# Altium project PiDSP.PrjPcb (part 2 of 2)

## Sheet DSPPower.SchDoc: Decoupling
size A4; Date: 08.04.2017; Author: Jan Petrik; CompanyName: FreeDSP; DrawnBy: Jan Petrik; Organization: FreeDSP; DocumentNumber: 7; Revision: B3; SheetNumber: 7; SheetTotal: 16; email: jan_petrik@centrum.cz; license: CC BY-NC 4.0
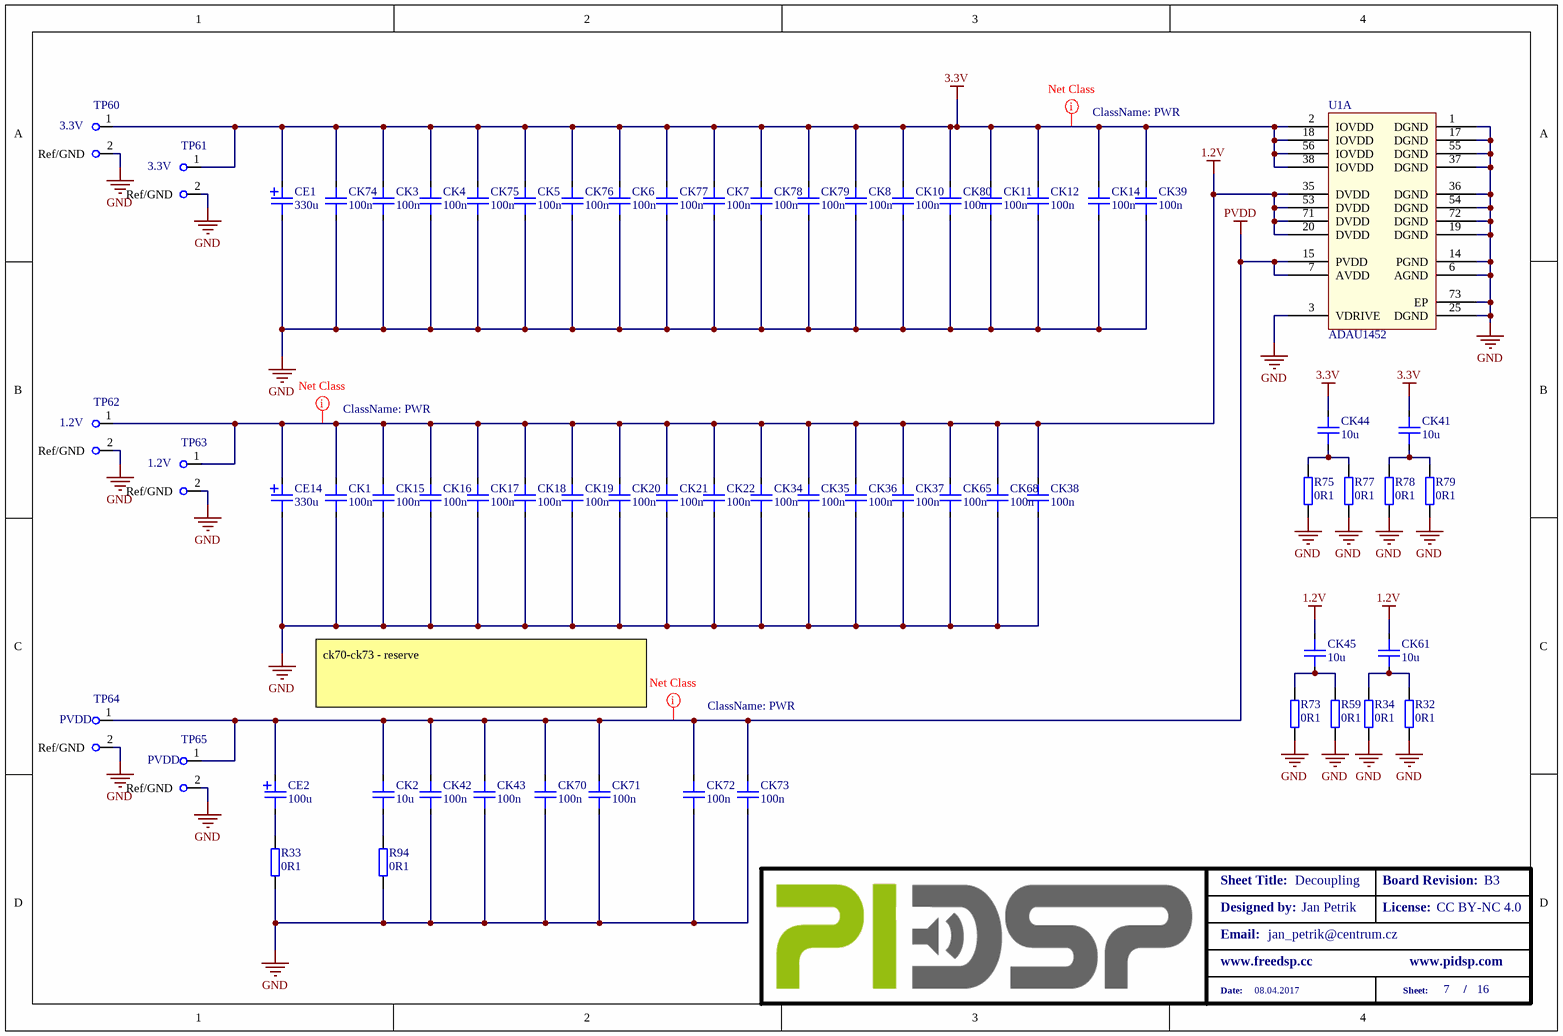
[diagram p10: DSPPower.SchDoc]

### Parts
CE1  330u  [CAPAE6.8X6.8(D_SIZE)]
CE2  100u  [CAPAE6.8X6.8(D_SIZE)]
CE14  330u  [CAPAE6.8X6.8(D_SIZE)]
CK1  100n  [CAPC1608X09N(SMC0603)]
CK2  10u  [CAPC3216X12N(SMC1206)]
CK3  100n  [CAPC1608X09N(SMC0603)_Fanout]
CK4  100n  [CAPC1608X09N(SMC0603)_Fanout]
CK5  100n  [CAPC1608X09N(SMC0603)_Fanout]
CK6  100n  [CAPC1608X09N(SMC0603)_Fanout]
CK7  100n  [CAPC1608X09N(SMC0603)_Fanout]
CK8  100n  [CAPC1608X09N(SMC0603)_Fanout]
CK10  100n  [CAPC1608X09N(SMC0603)_Fanout]
CK11  100n  [CAPC1608X09N(SMC0603)]
CK12  100n  [CAPC1608X09N(SMC0603)]
CK14  100n  [CAPC1608X09N(SMC0603)]
CK15  100n  [CAPC1608X09N(SMC0603)]
CK16  100n  [CAPC1608X09N(SMC0603)]
CK17  100n  [CAPC1608X09N(SMC0603)]
CK18  100n  [CAPC1608X09N(SMC0603)]
CK19  100n  [CAPC1608X09N(SMC0603)]
CK20  100n  [CAPC1608X09N(SMC0603)]
CK21  100n  [CAPC1608X09N(SMC0603)]
CK22  100n  [CAPC1608X09N(SMC0603)]
CK34  100n  [CAPC1608X09N(SMC0603)]
CK35  100n  [CAPC1608X09N(SMC0603)]
CK36  100n  [CAPC1608X09N(SMC0603)]
CK37  100n  [CAPC1608X09N(SMC0603)]
CK38  100n  [CAPC1608X09N(SMC0603)]
CK39  100n  [CAPC1608X09N(SMC0603)]
CK41  10u  [CAPC3216X12N(SMC1206)]
CK42  100n  [CAPC1608X09N(SMC0603)]
CK43  100n  [CAPC1608X09N(SMC0603)]
CK44  10u  [CAPC3216X12N(SMC1206)]
CK45  10u  [CAPC3216X12N(SMC1206)]
CK61  10u  [CAPC3216X12N(SMC1206)]
CK65  100n  [CAPC1608X09N(SMC0603)]
CK68  100n  [CAPC1608X09N(SMC0603)]
CK70  100n  [CAPC1608X09N(SMC0603)]
CK71  100n  [CAPC1608X09N(SMC0603)]
CK72  100n  [CAPC1608X09N(SMC0603)]
CK73  100n  [CAPC1608X09N(SMC0603)]
CK74  100n  [CAPC1608X09N(SMC0603)_Fanout]
CK75  100n  [CAPC1608X09N(SMC0603)_Fanout]
CK76  100n  [CAPC1608X09N(SMC0603)_Fanout]
CK77  100n  [CAPC1608X09N(SMC0603)_Fanout]
CK78  100n  [CAPC1608X09N(SMC0603)_Fanout]
CK79  100n  [CAPC1608X09N(SMC0603)_Fanout]
CK80  100n  [CAPC1608X09N(SMC0603)_Fanout]
R32  0R1  [RESC1608X06N(SMR0603)]
R33  0R1  [RESC1608X06N(SMR0603)]
R34  0R1  [RESC1608X06N(SMR0603)]
R59  0R1  [RESC1608X06N(SMR0603)]
R73  0R1  [RESC1608X06N(SMR0603)]
R75  0R1  [RESC1608X06N(SMR0603)]
R77  0R1  [RESC1608X06N(SMR0603)]
R78  0R1  [RESC1608X06N(SMR0603)]
R79  0R1  [RESC1608X06N(SMR0603)]
R94  0R1  [RESC1608X06N(SMR0603)]
TP60  3.3V  [HS/PDN_Testpoint]  (no BOM)
TP61  3.3V  [HS/PDN_Testpoint]  (no BOM)
TP62  1.2V  [HS/PDN_Testpoint]  (no BOM)
TP63  1.2V  [HS/PDN_Testpoint]  (no BOM)
TP64  PVDD  [HS/PDN_Testpoint]  (no BOM)
TP65  PVDD  [HS/PDN_Testpoint]  (no BOM)
U1  ADAU1452  [CP_72_6-handsoldering]  (part A of 6)

### Nets
1.2V: CE14.1 CK1.1 CK15.1 CK16.1 CK17.1 CK18.1 CK19.1 CK20.1 CK21.1 CK22.1 CK34.1 CK35.1 CK36.1 CK37.1 CK38.1 CK45.1 CK61.1 CK65.1 CK68.1 TP62.1 TP63.1 U1.20(DVDD) U1.35(DVDD) U1.53(DVDD) U1.71(DVDD)
3.3V: CE1.1 CK3.1 CK4.1 CK5.1 CK6.1 CK7.1 CK8.1 CK10.1 CK11.1 CK12.1 CK14.1 CK39.1 CK41.1 CK44.1 CK74.1 CK75.1 CK76.1 CK77.1 CK78.1 CK79.1 CK80.1 TP60.1 TP61.1 U1.2(IOVDD) U1.18(IOVDD) U1.38(IOVDD) U1.56(IOVDD)
GND: CE1.2 CE14.2 CK1.2 CK3.2 CK4.2 CK5.2 CK6.2 CK7.2 CK8.2 CK10.2 CK11.2 CK12.2 CK14.2 CK15.2 CK16.2 CK17.2 CK18.2 CK19.2 CK20.2 CK21.2 CK22.2 CK34.2 CK35.2 CK36.2 CK37.2 CK38.2 CK39.2 CK42.2 CK43.2 CK65.2 CK68.2 CK70.2 CK71.2 CK72.2 CK73.2 CK74.2 CK75.2 CK76.2 CK77.2 CK78.2 CK79.2 CK80.2 R32.2 R33.2 R34.2 R59.2 R73.2 R75.2 R77.2 R78.2 R79.2 R94.2 TP60.2(Ref/GND) TP61.2(Ref/GND) TP62.2(Ref/GND) TP63.2(Ref/GND) TP64.2(Ref/GND) TP65.2(Ref/GND) U1.1(DGND) U1.3(VDRIVE) U1.6(AGND) U1.14(PGND) U1.17(DGND) U1.19(DGND) U1.25(DGND) U1.36(DGND) U1.37(DGND) U1.54(DGND) U1.55(DGND) U1.72(DGND) U1.73(EP)
PVDD: CE2.1 CK2.1 CK42.1 CK43.1 CK70.1 CK71.1 CK72.1 CK73.1 TP64.1 TP65.1 U1.7(AVDD) U1.15(PVDD)
NetCE2_2: CE2.2 R33.1
NetCK2_2: CK2.2 R94.1
NetCK41_2: CK41.2 R78.1 R79.1
NetCK44_2: CK44.2 R75.1 R77.1
NetCK45_2: CK45.2 R59.1 R73.1
NetCK61_2: CK61.2 R32.1 R34.1

### Layout directives
net class PWR: 1.2V, 3.3V, PVDD

### Notes on the sheet
- ck70-ck73 - reserve
- Designed by:
- Sheet Title:
- Board Revision:
- License:
- Email:
- www.freedsp.cc
- www.pidsp.com
- Date:
- Sheet:
- /

### Library data of the parts
CE1 CE14 = 330u-6.3V-B6-OSCON: Polymer Aluminium Solid Capacitor 330uF, 6.3V; Signal Integrity: Cap; Tolerance: 20%/35V; Value: 330u; Package: D8H6.3; Simulation: Cap; Author: JP/27.03.2014; Voltage: 6.3V; Supplier 1: Mouser; Supplier Part Number 1: 710-875105144010
CE2 = 100u-16V-B6-OSCON: Polymer Aluminium Solid Capacitor 100uF, 16V; Mfg. Part Number: 875105344010; Signal Integrity: Cap; Tolerance: 20%/16V; Mfgr.: Wurth; Value: 100u; Package: D8H6.3; Simulation: Cap; Author: JP/27.03.2014; Voltage: 16V; Supplier 1: Mouser; Supplier Part Number 1: 710-875105344010
CK1 CK3 CK4 CK15 CK16 CK22 CK34-CK38 CK42 CK65 CK68 = 100n-50V-0603-X7R: MLCC; Signal Integrity: Cap; Tolerance: 10%; Voltage: 50V; Value: 100n; Package: SMC2523; Simulation: Cap; Author: JP/27.03.2014; Supplier 1: Mouser; Supplier Part Number 1: 81-GRM39X104K50D
CK2 CK41 CK44 CK45 CK61 = 10u-50V-1206-X5R: MLCC; Signal Integrity: Cap; Tolerance: 10%; Voltage: 50; Mfgr. PN: GRM31CR61H106MA2L; Mfgr.: Murata; Value: 10u; Package: SMC1206; Simulation: Cap; Author: JP/10.06.2014; Supplier 1: Mouser; Supplier Part Number 1: 81-GRM31CR61H106MA2L
CK5-CK8 CK10-CK12 CK14 CK17-CK21 CK39 CK43 CK70-CK80 = 100n-50V-0603-X7R: MLCC; Signal Integrity: Cap; Voltage: 50V; Tolerance: 10%; Value: 100n; Package: SMC2523; Simulation: Cap; Author: JP/27.03.2014; Supplier 1: Mouser; Supplier Part Number 1: 81-GRM39X104K50D
R32-R34 R59 R73 R75 R77-R79 R94 = 0R1-100mW-0603-ThickFilm: Chip Resistor; Tolerance & Rating: 1%/0.1W; Signal Integrity: Res; Packare: SMR0603; Value: 0R1; Simulation: Res; Author: JP/10.06.2014; SMD: 1; Supplier 1: Farnell; Supplier Part Number 1: 8867364; Type: Resistor
TP60-TP65 = TEST_POINT_HS/PDN: Testpoint - HS/PDN; SMD: 0
U1 = ADAU1452: SMD: 1; Supplier 1: Mouser; Supplier Part Number 1: 584-ADAU1452WBCPZ

## Sheet IOConn.SchDoc: I/O Connectors
size A4; Date: 08.04.2017; Author: Jan Petrik; CompanyName: FreeDSP; DrawnBy: Jan Petrik; Organization: FreeDSP; DocumentNumber: 12; Revision: B2; SheetNumber: 12; SheetTotal: 16; Version1: N/A; Version2: N/A; Version3: N/A; Change1description: N/A; Change2description: N/A; Change3description: N/A; Change1DrawnBy: N/A; Change2DrawnBy: N/A; Change3DrawnBy: N/A; Change1CheckedBy: N/A; Change2CheckedBy: N/A; Change3CheckedBy: N/A; PreviusVersion_Chng1: N/A; PreviusVersion_Chng2: N/A; PreviusVersion_Chng3: N/A; Variant1description: Standard assembly; Variant2description: N/A; Variant3description: N/A; Variant4description: N/A; email: jan_petrik@centrum.cz; license: CC BY-NC 4.0
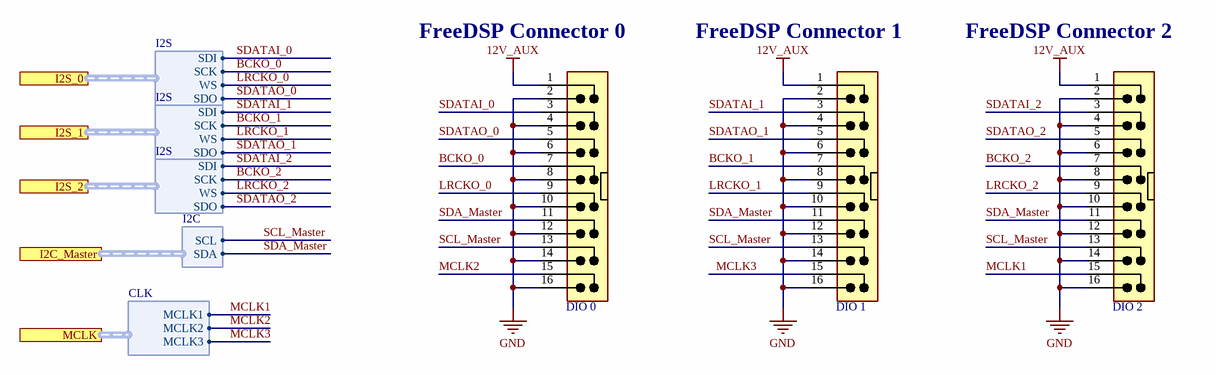
[diagram p11: IOConn.SchDoc]

### Parts
DIO_0  EJ-MLW16G  [MLW16G]  (value not drawn)
DIO_1  EJ-MLW16G  [MLW16G]  (value not drawn)
DIO_2  EJ-MLW16G  [MLW16G]  (value not drawn)

### Ports
I2C_Master (harness I2C), I2S_0 (harness I2S), I2S_1 (harness I2S), I2S_2 (harness I2S), MCLK (harness CLK)

### Harnesses
I2C: SDA, SCL
I2S: SDI, WS, SCK, SDO
CLK: MCLK1, MCLK2, MCLK3

### Nets
12V_AUX: DIO_0.1 DIO_1.1 DIO_2.1
GND: DIO_0.2 DIO_0.4 DIO_0.6 DIO_0.8 DIO_0.10 DIO_0.12 DIO_0.14 DIO_0.16 DIO_1.2 DIO_1.4 DIO_1.6 DIO_1.8 DIO_1.10 DIO_1.12 DIO_1.14 DIO_1.16 DIO_2.2 DIO_2.4 DIO_2.6 DIO_2.8 DIO_2.10 DIO_2.12 DIO_2.14 DIO_2.16
BCKO_0: DIO_0.7 ; port I2S_0.SCK
BCKO_1: DIO_1.7 ; port I2S_1.SCK
BCKO_2: DIO_2.7 ; port I2S_2.SCK
LRCKO_0: DIO_0.9 ; port I2S_0.WS
LRCKO_1: DIO_1.9 ; port I2S_1.WS
LRCKO_2: DIO_2.9 ; port I2S_2.WS
MCLK1: DIO_2.15 ; port MCLK.MCLK1
MCLK2: DIO_0.15 ; port MCLK.MCLK2
MCLK3: DIO_1.15 ; port MCLK.MCLK3
SCL_Master: DIO_0.13 DIO_1.13 DIO_2.13 ; port I2C_Master.SCL
SDA_Master: DIO_0.11 DIO_1.11 DIO_2.11 ; port I2C_Master.SDA
SDATAI_0: DIO_0.3 ; port I2S_0.SDI  [project net MDI_0]
SDATAI_1: DIO_1.3 ; port I2S_1.SDI  [project net MDI_1]
SDATAI_2: DIO_2.3 ; port I2S_2.SDI  [project net MDI_2]
SDATAO_0: DIO_0.5 ; port I2S_0.SDO  [project net MDO_0]
SDATAO_1: DIO_1.5 ; port I2S_1.SDO  [project net MDO_1]
SDATAO_2: DIO_2.5 ; port I2S_2.SDO  [project net MDO_2]

### Notes on the sheet
- (near DIO_0) FreeDSP Connector 0
- (near DIO_1) FreeDSP Connector 1
- (near DIO_2) FreeDSP Connector 2
- Designed by:
- Sheet Title:
- Board Revision:
- License:
- Email:
- www.freedsp.cc
- www.pidsp.com
- Date:
- Sheet:
- /

### Library data of the parts
DIO_0-DIO_2 = MLW 2x8: IDC Male Header for PCB 2x8 Pin, Straight; Author: JM 26.2.2015; SMD: 0; Supplier 1: Mouser; Supplier Part Number 1: 710-61201621621

## Sheet SPDIF.SchDoc
size A4; Date: 08.04.2017; ApprovedBy: ApprovedBy; CheckedBy: CheckedBy; Author: Jan Petrik; CompanyName: FreeDSP; DrawnBy: Jan Petrik; Organization: FreeDSP; DocumentNumber: 13; Revision: B2; SheetNumber: 13; SheetTotal: 16; Version1: N/A; Version2: N/A; Version3: N/A; Change1description: N/A; Change2description: N/A; Change3description: N/A; Change1DrawnBy: N/A; Change2DrawnBy: N/A; Change3DrawnBy: N/A; Change1CheckedBy: N/A; Change2CheckedBy: N/A; Change3CheckedBy: N/A; PreviusVersion_Chng1: N/A; PreviusVersion_Chng2: N/A; PreviusVersion_Chng3: N/A; Variant1description: Standard assembly; Variant2description: N/A; Variant3description: N/A; Variant4description: N/A; email: jan_petrik@centrum.cz; license: CC BY-NC 4.0; PageSetup: Record=PageOptions|CenterHorizontal=True|CenterVertical=True|PrintScale=0.97|XCorrection=1.00|YCorrection=1.00|PrintKind=2|BorderSize=5000000|LeftOffset=0|BottomOffset=0|Orientation=2|PaperLength=1000|PaperWidth=1000|Scale=100|PaperSource=7|PrintQuality=-3|MediaType=1|DitherType=10|PrintScaleMode=1|PaperKind=A4|PaperIndex=9; drawing number: blablabla; DocumentName: Docname
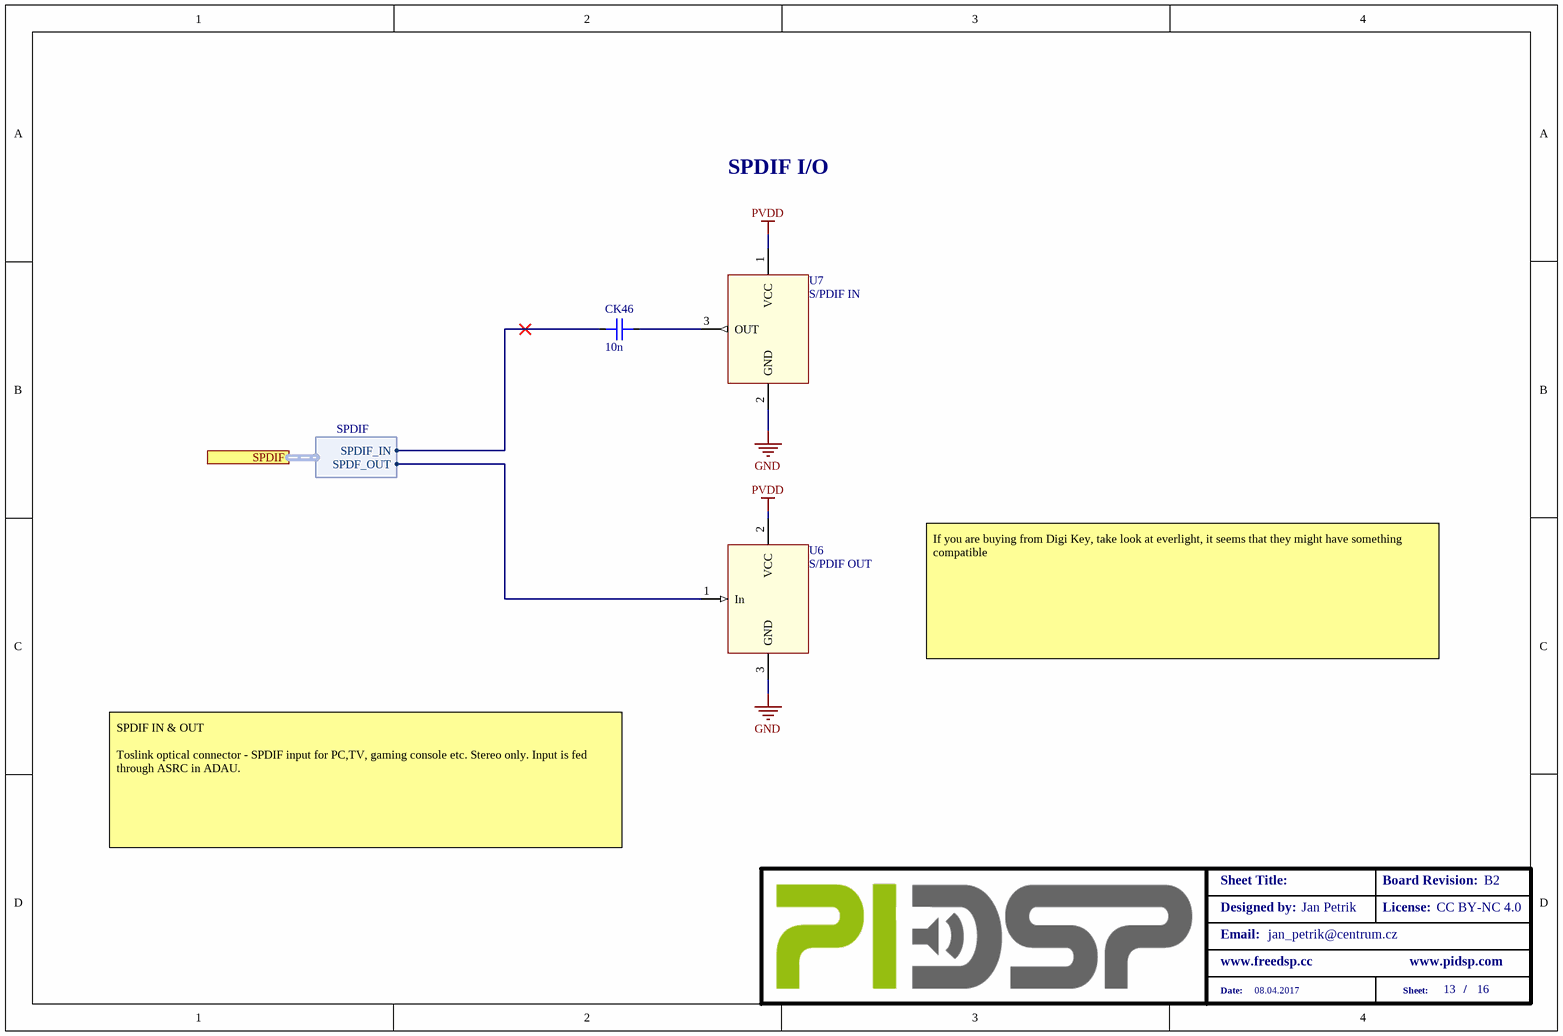
[diagram p12: SPDIF.SchDoc]

### Parts
CK46  10n  [CAPC1608X09N(SMC0603)]
U6  S/PDIF OUT  [OTJ/ORJ 8]
U7  S/PDIF IN  [OTJ/ORJ 8]

### Ports
SPDIF (harness SPDIF)

### Harnesses
SPDIF: SPDIF_IN, SPDF_OUT

### Nets
GND: U6.3(GND) U7.2(GND)
PVDD: U6.2(VCC) U7.1(VCC)
SPDIF_IN: CK46.2 ; port SPDIF.SPDIF_IN
SPDIF_OUT: U6.1(In) ; port SPDIF.SPDF_OUT
NetCK46_1: CK46.1 U7.3(OUT)

### Notes on the sheet
- SPDIF I/O
- If you are buying from Digi Key, take look at everlight, it seems that they might have something compatible
- SPDIF IN & OUT
  Toslink optical connector - SPDIF input for PC,TV, gaming console etc. Stereo only. Input is fed through ASRC in ADAU.
- Designed by:
- Sheet Title:
- Board Revision:
- License:
- Email:
- www.freedsp.cc
- www.pidsp.com
- Date:
- Sheet:
- /

### Library data of the parts
CK46 = 10n-50V-0603-X7R: MLCC; Signal Integrity: Cap; Tolerance: 10%; Voltage: 50V; Value: 10n; Package: SMC0603; Simulation: Cap; Author: JP/27.03.2014; Supplier 1: Mouser; Supplier Part Number 1: 81-GRM39X103K50D
U6 = OTJ-8: Toslink Transmitter; Value: OTJ-8; SMD: 0; Supplier 1: TME; Supplier Part Number 1: FC684208T
U7 = ORJ-8: Toslink Reciever; Value: ORJ-8; SMD: 0; Supplier 1: TME; Supplier Part Number 1: FC684208R

## Sheet FrontPanelConnector.SchDoc
size A4; Date: 08.04.2017; ApprovedBy: ApprovedBy; CheckedBy: CheckedBy; Author: Jan Petrik; CompanyName: FreeDSP; DrawnBy: Jan Petrik; Organization: FreeDSP; DocumentNumber: 15; Revision: B2; SheetNumber: 15; SheetTotal: 16; Version1: N/A; Version2: N/A; Version3: N/A; Change1description: N/A; Change2description: N/A; Change3description: N/A; Change1DrawnBy: N/A; Change2DrawnBy: N/A; Change3DrawnBy: N/A; Change1CheckedBy: N/A; Change2CheckedBy: N/A; Change3CheckedBy: N/A; PreviusVersion_Chng1: N/A; PreviusVersion_Chng2: N/A; PreviusVersion_Chng3: N/A; Variant1description: Standard assembly; Variant2description: N/A; Variant3description: N/A; Variant4description: N/A; email: jan_petrik@centrum.cz; license: CC BY-NC 4.0; PageSetup: Record=PageOptions|CenterHorizontal=True|CenterVertical=True|PrintScale=0.97|XCorrection=1.00|YCorrection=1.00|PrintKind=2|BorderSize=5000000|LeftOffset=0|BottomOffset=0|Orientation=2|PaperLength=1000|PaperWidth=1000|Scale=100|PaperSource=7|PrintQuality=-3|MediaType=1|DitherType=10|PrintScaleMode=1|PaperKind=A4|PaperIndex=9; drawing number: blablabla; DocumentName: Docname
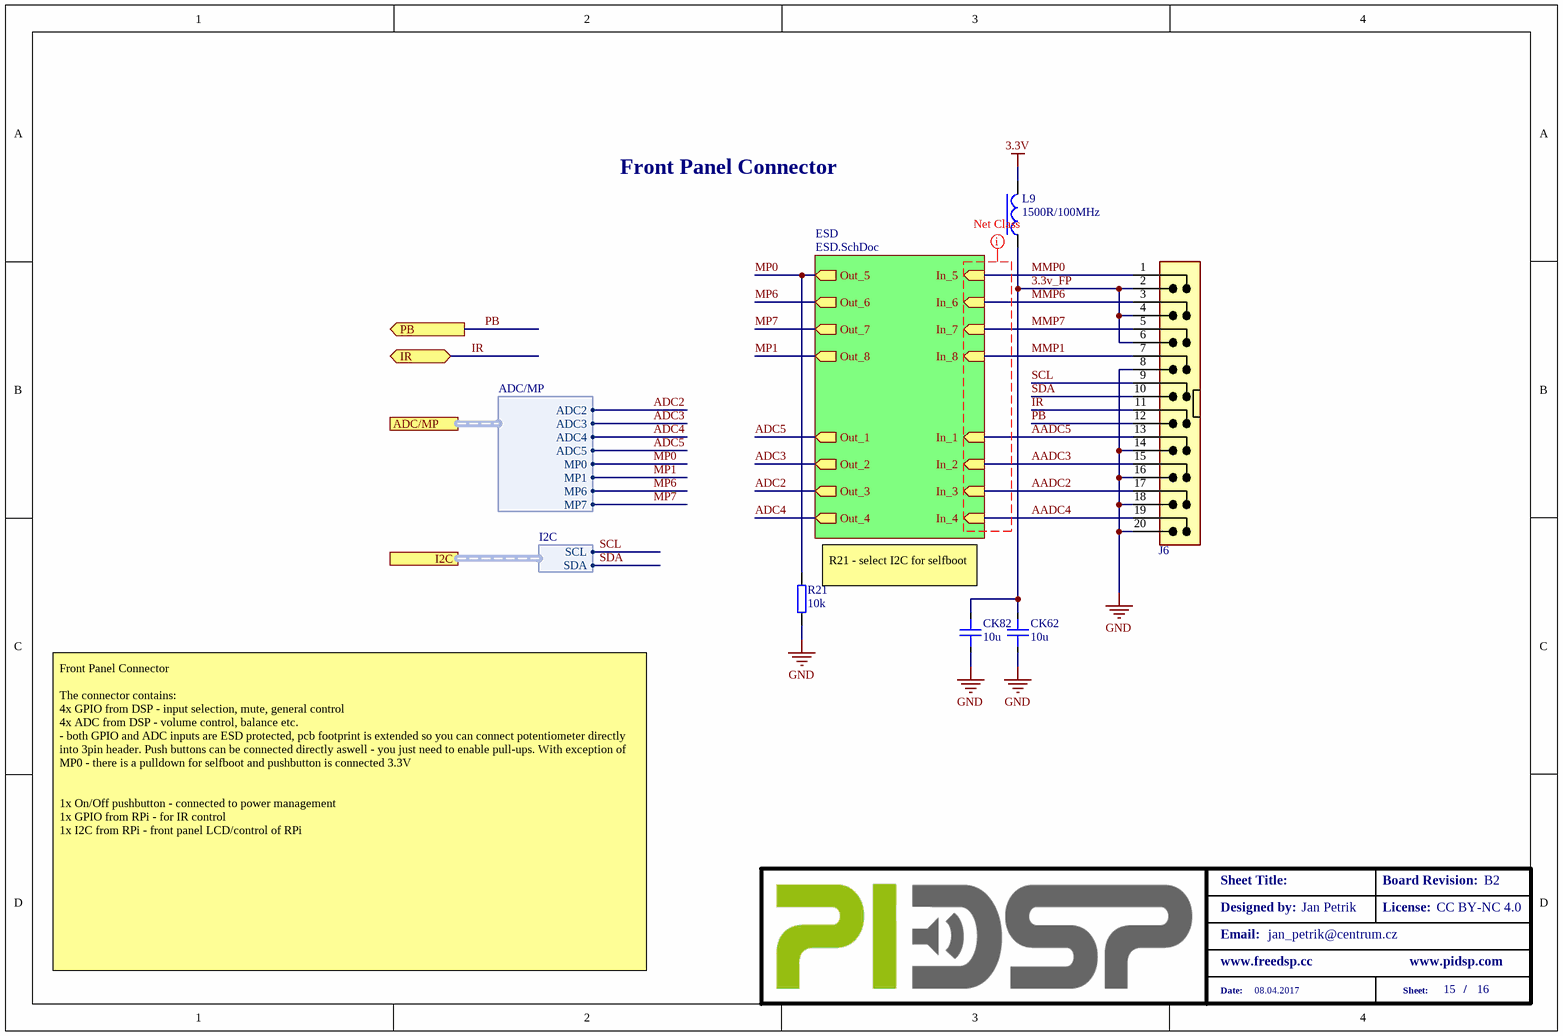
[diagram p13: FrontPanelConnector.SchDoc]

### Parts
CK62  10u  [CAPC3216X12N(SMC1206)]
CK82  10u  [CAPC3216X12N(SMC1206)]
J6  MLW 2x10  [MLW20G_BG]  (value not drawn)
L9  1500R/100MHz  [INDC2012X08N(SML0805)]
R21  10k  [RESC1608X06N(SMR0603)]

### Sub-sheets
ESD = ESD.SchDoc: In_7 (in), In_4 (in), In_3 (in), Out_7 (out), In_8 (in), Out_8 (out), In_6 (in), In_5 (in), Out_5 (out), Out_6 (out), Out_2 (out), Out_4 (out), In_1 (in), In_2 (in), Out_3 (out), Out_1 (out)

### Ports
ADC/MP (harness ADC/MP), I2C (harness I2C), IR (bidir), PB (out)

### Harnesses
ADC/MP: ADC2, ADC3, ADC4, ADC5, MP1, MP0, MP7, MP6
I2C: SCL, SDA

### Nets
3.3V: L9.2
GND: CK62.2 CK82.2 J6.8 J6.14 J6.16 J6.18 J6.20 R21.1
3.3v_FP: CK62.1 CK82.1 J6.2 J6.4 J6.6 L9.1
AADC2: J6.17 ; sheet ESD/In_3
AADC3: J6.15 ; sheet ESD/In_2
AADC4: J6.19 ; sheet ESD/In_4
AADC5: J6.13 ; sheet ESD/In_1
ADC2: sheet ESD/Out_3, port ADC/MP.ADC2
ADC3: sheet ESD/Out_2, port ADC/MP.ADC3
ADC4: sheet ESD/Out_4, port ADC/MP.ADC4
ADC5: sheet ESD/Out_1, port ADC/MP.ADC5
IR: J6.11 ; port IR
MMP0: J6.1 ; sheet ESD/In_5
MMP1: J6.7 ; sheet ESD/In_8
MMP6: J6.3 ; sheet ESD/In_6
MMP7: J6.5 ; sheet ESD/In_7
MP0: R21.2 ; sheet ESD/Out_5, port ADC/MP.MP0
MP1: sheet ESD/Out_8, port ADC/MP.MP1
MP6: sheet ESD/Out_6, port ADC/MP.MP6
MP7: sheet ESD/Out_7, port ADC/MP.MP7
PB: J6.12 ; port PB
SCL: J6.9 ; port I2C.SCL
SDA: J6.10 ; port I2C.SDA

### Layout directives
net class ReducedClearence: (no net found under the mark)

### Notes on the sheet
- Front Panel Connector
- R21 - select I2C for selfboot
- Front Panel Connector
  The connector contains:
  4x GPIO from DSP - input selection, mute, general control
  4x ADC from DSP - volume control, balance etc.
  - both GPIO and ADC inputs are ESD protected, pcb footprint is extended so you can connect potentiometer directly into 3pin header. Push buttons can be connected directly aswell - you just need to enable pull-ups. With exception of  MP0 - there is a pulldown for selfboot and pushbutton is connected 3.3V
  1x On/Off pushbutton - connected to power management
  1x GPIO from RPi - for IR control
  1x I2C from RPi - front panel LCD/control of RPi
- Designed by:
- Sheet Title:
- Board Revision:
- License:
- Email:
- www.freedsp.cc
- www.pidsp.com
- Date:
- Sheet:
- /

### Library data of the parts
CK62 CK82 = 10u-50V-1206-X5R: as CK2 on sheet DSPPower; Value: 10u; Package: SMC1206; Simulation: Cap; Author: JP/10.06.2014; Supplier 1: Mouser; Supplier Part Number 1: 81-GRM31CR61H106MA2L
L9 = MMZ2012Y152B: Multilayer SMD Ferrite 1500R/100MHz; Tolerance & Rating: 25%, 100mA/0.55Ohm RDC; Value: 1500R/100MHz; Author: JP/05.06.2014; SMD: 1; Supplier 1: Mouser; Supplier Part Number 1: 810-MMZ2012Y152B
R21 = 10k-100mW-0603-ThickFilm: Chip Resistor; Tolerance & Rating: 1%/0.1W; Signal Integrity: Res; Packare: SMR0603; Value: 10k; Simulation: Res; Author: JP/10.06.2014; SMD: 1; Supplier 1: Mouser; Supplier Part Number 1: 603-RC0603FR-0710KL; Type: Resistor
J6 = MLW 2x10: smd: 0; Supplier 1: Mouser; Supplier Part Number 1: 710-61202021621

## Sheet ESD.SchDoc: ESD Protection
size A4 portrait; Date: 08.04.2017; CheckedBy: CheckedBy; Author: Jan Petrik; CompanyName: FreeDSP; DrawnBy: Jan Petrik; Organization: FreeDSP; DocumentNumber: 16; Revision: B2; SheetNumber: 16; SheetTotal: 16; Version1: N/A; Version2: N/A; Version3: N/A; Change1description: N/A; Change2description: N/A; Change3description: N/A; Change1DrawnBy: N/A; Change2DrawnBy: N/A; Change3DrawnBy: N/A; Change1CheckedBy: N/A; Change2CheckedBy: N/A; Change3CheckedBy: N/A; PreviusVersion_Chng1: N/A; PreviusVersion_Chng2: N/A; PreviusVersion_Chng3: N/A; Variant1description: Standard assembly; Variant2description: N/A; Variant3description: N/A; Variant4description: N/A; PageSetup: Record=PageOptions|CenterHorizontal=True|CenterVertical=True|PrintScale=0.97|XCorrection=1.00|YCorrection=1.00|PrintKind=2|BorderSize=5000000|LeftOffset=0|BottomOffset=0|Orientation=2|PaperLength=1000|PaperWidth=1000|Scale=100|PaperSource=7|PrintQuality=-3|MediaType=1|DitherType=10|PrintScaleMode=1|PaperKind=A4|PaperIndex=9; drawing number: blablabla; email: jan_petrik@centrum.cz; license: CC BY-NC 4.0; DocumentName: Docname
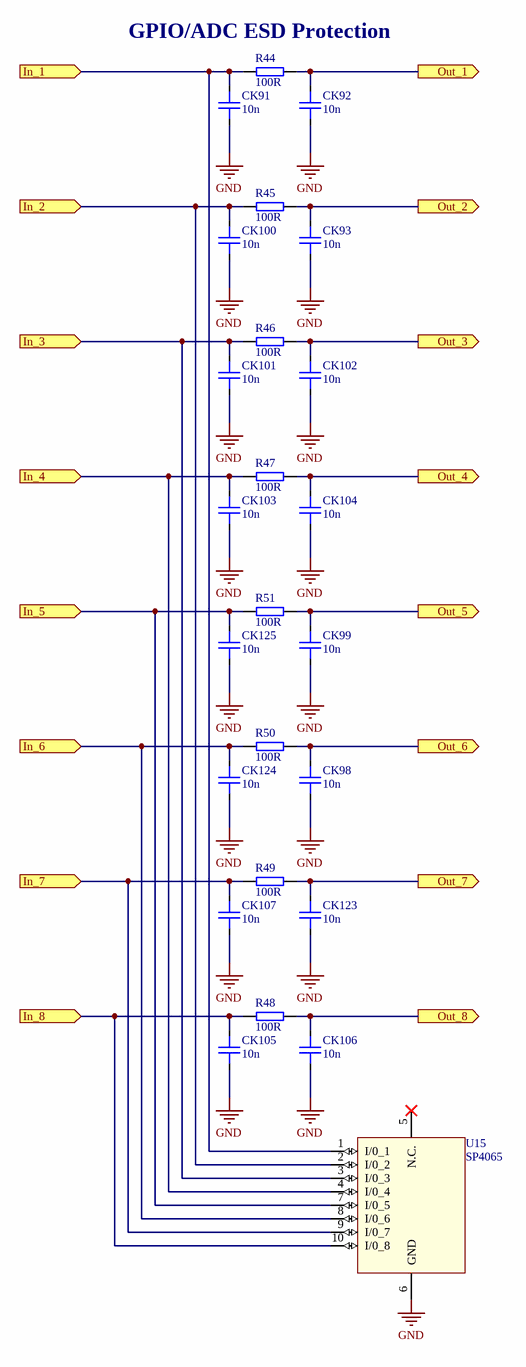
[diagram p14: ESD.SchDoc]

### Parts
CK91  10n  [CAPC1608X09N(SMC0603)]
CK92  10n  [CAPC1608X09N(SMC0603)]
CK93  10n  [CAPC1608X09N(SMC0603)]
CK98  10n  [CAPC1608X09N(SMC0603)]
CK99  10n  [CAPC1608X09N(SMC0603)]
CK100  10n  [CAPC1608X09N(SMC0603)]
CK101  10n  [CAPC1608X09N(SMC0603)]
CK102  10n  [CAPC1608X09N(SMC0603)]
CK103  10n  [CAPC1608X09N(SMC0603)]
CK104  10n  [CAPC1608X09N(SMC0603)]
CK105  10n  [CAPC1608X09N(SMC0603)]
CK106  10n  [CAPC1608X09N(SMC0603)]
CK107  10n  [CAPC1608X09N(SMC0603)]
CK123  10n  [CAPC1608X09N(SMC0603)]
CK124  10n  [CAPC1608X09N(SMC0603)]
CK125  10n  [CAPC1608X09N(SMC0603)]
R44  100R  [RESC1608X06N(SMR0603)]
R45  100R  [RESC1608X06N(SMR0603)]
R46  100R  [RESC1608X06N(SMR0603)]
R47  100R  [RESC1608X06N(SMR0603)]
R48  100R  [RESC1608X06N(SMR0603)]
R49  100R  [RESC1608X06N(SMR0603)]
R50  100R  [RESC1608X06N(SMR0603)]
R51  100R  [RESC1608X06N(SMR0603)]
U15  SP4065  [TSSOP50P490X110-10N(MSOP10)]

### Ports
In_1 (in), In_2 (in), In_3 (in), In_4 (in), In_5 (in), In_6 (in), In_7 (in), In_8 (in), Out_1 (out), Out_2 (out), Out_3 (out), Out_4 (out), Out_5 (out), Out_6 (out), Out_7 (out), Out_8 (out)

### Nets
GND: CK91.2 CK92.2 CK93.2 CK98.2 CK99.2 CK100.2 CK101.2 CK102.2 CK103.2 CK104.2 CK105.2 CK106.2 CK107.2 CK123.2 CK124.2 CK125.2 U15.6(GND)
AADC2: CK101.1 R46.1 U15.3(I/0_3) ; port In_3
AADC3: CK100.1 R45.1 U15.2(I/0_2) ; port In_2
AADC4: CK103.1 R47.1 U15.4(I/0_4) ; port In_4
AADC5: CK91.1 R44.1 U15.1(I/0_1) ; port In_1
ADC2: CK102.1 R46.2 ; port Out_3
ADC3: CK93.1 R45.2 ; port Out_2
ADC4: CK104.1 R47.2 ; port Out_4
ADC5: CK92.1 R44.2 ; port Out_1
MMP0: CK125.1 R51.1 U15.7(I/0_5) ; port In_5
MMP1: CK105.1 R48.1 U15.10(I/0_8) ; port In_8
MMP6: CK124.1 R50.1 U15.8(I/0_6) ; port In_6
MMP7: CK107.1 R49.1 U15.9(I/0_7) ; port In_7
MP0: CK99.1 R51.2 ; port Out_5
MP1: CK106.1 R48.2 ; port Out_8
MP6: CK98.1 R50.2 ; port Out_6
MP7: CK123.1 R49.2 ; port Out_7

Not connected (* = marked no-connect by the designer): U15 5(N.C.)*

### Notes on the sheet
- (near R44) GPIO/ADC ESD Protection
- Designed by:
- Sheet Title:
- Board Revision:
- License:
- Email:
- www.freedsp.cc
- www.pidsp.com
- Date:
- Sheet:
- /

### Library data of the parts
CK91-CK93 CK98-CK107 CK123-CK125 = 10n-50V-0603-X7R: MLCC; Signal Integrity: Cap; Tolerance: 10%; Voltage: 50V; Value: 10n; Package: SMC0603; Simulation: Cap; Author: JP/27.03.2014; Supplier 1: Mouser; Supplier Part Number 1: 81-GRM39X103K50D
R44-R51 = 100R-100mW-0603-ThickFilm: Chip Resistor; Tolerance & Rating: 1%/0.1W; Signal Integrity: Res; Packare: SMR0603; Value: 100R; Simulation: Res; Author: JP/10.06.2014; SMD: 1; Supplier 1: Mouser; Supplier Part Number 1: 603-RC0603FR-07100RL; Type: Resistor
U15 = SP4065: 3.3V 20A  Diode  ESD Array; SMD: 1; Supplier 1: Mouser; Value: SP4065; Supplier Part Number 1: 576-SP4065-08ATG

## Sheet USBi.SchDoc
size A4; Date: 08.04.2017; ApprovedBy: ApprovedBy; CheckedBy: CheckedBy; Author: Jan Petrik; CompanyName: FreeDSP; DrawnBy: Jan Petrik; Organization: FreeDSP; DocumentNumber: 14; Revision: B2; SheetNumber: 14; SheetTotal: 16; Version1: N/A; Version2: N/A; Version3: N/A; Change1description: N/A; Change2description: N/A; Change3description: N/A; Change1DrawnBy: N/A; Change2DrawnBy: N/A; Change3DrawnBy: N/A; Change1CheckedBy: N/A; Change2CheckedBy: N/A; Change3CheckedBy: N/A; PreviusVersion_Chng1: N/A; PreviusVersion_Chng2: N/A; PreviusVersion_Chng3: N/A; Variant1description: Standard assembly; Variant2description: N/A; Variant3description: N/A; Variant4description: N/A; email: jan_petrik@centrum.cz; license: CC BY-NC 4.0; DocumentName: Docname
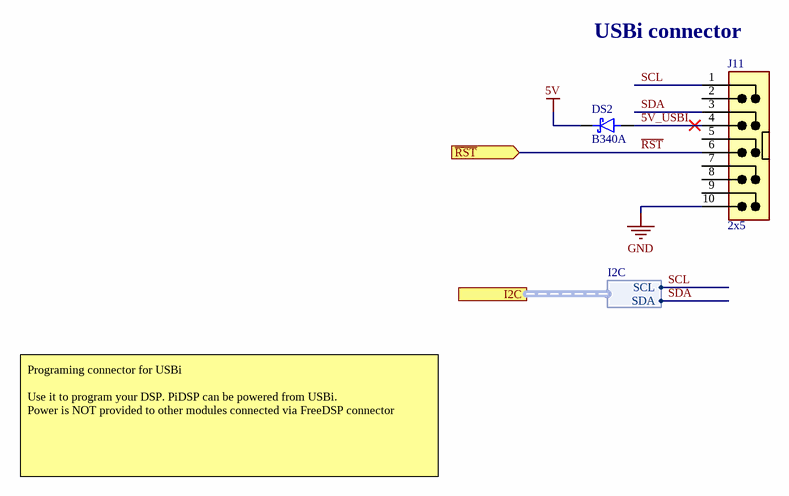
[diagram p15: USBi.SchDoc]

### Parts
DS2  B340A  [DIOM5127X23N(SMA)]
J11  2x5  [MLW10G_BK]

### Ports
I2C (harness I2C), ~{RST} (in)

### Harnesses
I2C: SCL, SDA

### Nets
5V: DS2.1(C)
GND: J11.10
5V_USBI: DS2.2(A) J11.4
~{RST}: J11.6 ; port ~{RST}
SCL: J11.1 ; port I2C.SCL
SDA: J11.3 ; port I2C.SDA

Not connected (* = marked no-connect by the designer): J11 2 5 7 8 9

### Notes on the sheet
- (near J11) USBi connector
- Programing connector for USBi
  Use it to program your DSP. PiDSP can be powered from USBi.
  Power is NOT provided to other modules connected via FreeDSP connector
- Designed by:
- Sheet Title:
- Board Revision:
- License:
- Email:
- www.freedsp.cc
- www.pidsp.com
- Date:
- Sheet:
- /

### Library data of the parts
DS2 = B340A: High Current Density SMT Schottky Rectifier, 3A/40V, SMA; SMD: 1; Supplier 1: Mouser; Supplier Part Number 1: 621-B340-F; Value: B340A
J11 = MLW 2x5: IDC Male Header for PCB 2x5 Pin, Straight; Author: JM 25.9.2014; SMD: 0; Supplier 1: Mouser; Supplier Part Number 1: 710-61201021621

## Nets that join several sheets
1.2V: TPS54292 (L1.2 R63.2), DSPPower (25 pins)
3.3V: DSPcontrol (10 pins), DSPclk (R10.2 R43.2 U2.2 U2.15), RPi&MCU (R5.2 U3.8), PowerSupply (D2.1 R20.2), TPS54292 (L2.2 R67.2), Buck+PM (R24.2), DSPPower (27 pins), FrontPanelConnector (L9.2)
5V: RPi&MCU (J4.2 J4.4), PowerSupply (DS3.1 R38.1 R76.2), LP5907MFX-3.3NPB (L5.1), TPS54292 (CK27.1 CK30.1 U11.1 U11.16), Buck+PM (5 pins), USBi (DS2.1)
12V_AUX: InputFilter (9 pins), IOConn (DIO_0.1 DIO_1.1 DIO_2.1)
GND: DSP (H1.1), DSPcontrol (9 pins), DSPclk (8 pins), RPi&MCU (12 pins), PowerSupply (21 pins), LP5907MFX-3.3NPB (CK29.2 CK88.2 U10.2), TPS54292 (17 pins), InputFilter (8 pins), Buck+PM (19 pins), DSPPower (71 pins), IOConn (24 pins), SPDIF (U6.3 U7.2), FrontPanelConnector (8 pins), ESD (17 pins), USBi (J11.10)
PVDD: DSPcontrol (CK9.1 CK13.1), DSPclk (X1.4 X2.4), LP5907MFX-3.3NPB (U10.5), DSPPower (12 pins), SPDIF (U6.2 U7.1)
12V_DIS: DSP_DIO (U1.50), InputFilter (R40.2 T7.1)
~{RST}: DSPcontrol (7 pins), RPi&MCU (J4.33), USBi (J11.6)
AADC2: FrontPanelConnector (J6.17), ESD (CK101.1 R46.1 U15.3)
AADC3: FrontPanelConnector (J6.15), ESD (CK100.1 R45.1 U15.2)
AADC4: FrontPanelConnector (J6.19), ESD (CK103.1 R47.1 U15.4)
AADC5: FrontPanelConnector (J6.13), ESD (CK91.1 R44.1 U15.1)
ADC2: DSPcontrol (U1.10), ESD (CK102.1 R46.2)
ADC3: DSPcontrol (U1.11), ESD (CK93.1 R45.2)
ADC4: DSPcontrol (U1.12), ESD (CK104.1 R47.2)
ADC5: DSPcontrol (U1.13), ESD (CK92.1 R44.2)
BCKI_3: DSP_DIO (U1.68), RPi&MCU (J4.12)
BCKO_0: DSP_DIO (R1.1), IOConn (DIO_0.7)
BCKO_1: DSP_DIO (R27.1), IOConn (DIO_1.7)
BCKO_2: DSP_DIO (R30.1), IOConn (DIO_2.7)
CLK_DSP: DSPcontrol (U1.21), DSPclk (TP17.1 U2.14)
CLK_SEL: DSPclk (R10.1 T3.1 TP6.1 X1.1), RPi&MCU (J4.37)
DSP_DIS: RPi&MCU (J4.31), PowerSupply (R81.2 T4.1 TP13.1)
EXT_CLK: DSPclk (R42.2 TP5.1 U2.16), RPi&MCU (J4.36)
~{INT}: DSP_DIO (U1.58), RPi&MCU (J4.15), Buck+PM (R24.1 TP2.1 U8.5)
IR: RPi&MCU (J4.18 TP21.1), FrontPanelConnector (J6.11)
~{KILL}: DSP_DIO (U1.61), RPi&MCU (J4.16), Buck+PM (R37.2 T5.1)
LRCKI_3: DSP_DIO (U1.69), RPi&MCU (J4.35)
LRCKO_0: DSP_DIO (R2.1), IOConn (DIO_0.9)
LRCKO_1: DSP_DIO (R28.1), IOConn (DIO_1.9)
LRCKO_2: DSP_DIO (R31.1), IOConn (DIO_2.9)
MCLK1: DSPclk (R8.2), IOConn (DIO_2.15)
MCLK2: DSPclk (R18.2), IOConn (DIO_0.15)
MCLK3: DSPclk (R19.2), IOConn (DIO_1.15)
MDI_0: DSP_DIO (U1.59), IOConn (DIO_0.3)
MDI_1: DSP_DIO (U1.62), IOConn (DIO_1.3)
MDI_2: DSP_DIO (U1.67), IOConn (DIO_2.3)
MDI_3: DSP_DIO (U1.70), RPi&MCU (R15.1)
MDO_0: DSP_DIO (R26.1), IOConn (DIO_0.5)
MDO_1: DSP_DIO (R29.1), IOConn (DIO_1.5)
MDO_2: DSP_DIO (R3.1), IOConn (DIO_2.5)
MDO_3: DSP_DIO (R6.1), RPi&MCU (J4.38)
MMP0: FrontPanelConnector (J6.1), ESD (CK125.1 R51.1 U15.7)
MMP1: FrontPanelConnector (J6.7), ESD (CK105.1 R48.1 U15.10)
MMP6: FrontPanelConnector (J6.3), ESD (CK124.1 R50.1 U15.8)
MMP7: FrontPanelConnector (J6.5), ESD (CK107.1 R49.1 U15.9)
MP0: DSPcontrol (U1.26), FrontPanelConnector (R21.2), ESD (CK99.1 R51.2)
MP1: DSPcontrol (U1.27), ESD (CK106.1 R48.2)
MP6: DSPcontrol (U1.45), ESD (CK98.1 R50.2)
MP7: DSPcontrol (U1.46), ESD (CK123.1 R49.2)
NetCK63_1: PowerSupply (CK63.1 D2.2 R20.1 TP11.1), LP5907MFX-3.3NPB (U10.3)
NetT2_3: PowerSupply (T2.3 TP9.1), TPS54292 (U11.6)
NetT8_3: PowerSupply (T8.3 TP12.1), TPS54292 (U11.5)
PB: Buck+PM (R88.1 TP14.1 U8.2), FrontPanelConnector (J6.12)
SBOOT: DSPcontrol (R14.1 TP26.1 U1.34), RPi&MCU (J4.32)
SCL: DSPcontrol (R22.1 TP22.1 U1.31), RPi&MCU (J4.5), FrontPanelConnector (J6.9), USBi (J11.1)
SCL_Master: DSPcontrol (R11.1 TP24.1 U1.28 U14.6), IOConn (DIO_0.13 DIO_1.13 DIO_2.13)
SDA: DSPcontrol (R23.1 TP23.1 U1.30), RPi&MCU (J4.3), FrontPanelConnector (J6.10), USBi (J11.3)
SDA_Master: DSPcontrol (R12.1 TP25.1 U1.29 U14.5), IOConn (DIO_0.11 DIO_1.11 DIO_2.11)
SPDIF_IN: DSP_DIO (TP16.1 U1.4), SPDIF (CK46.2)
SPDIF_OUT: DSP_DIO (TP15.1 U1.5), SPDIF (U6.1)
V_IN: InputFilter (CK26.1 L8.1 T1.4 TP49.1), Buck+PM (6 pins)

## Assembly variants
Standard Assembly: not fitted CK24 CK33 CK40 CK49 CK50 CK55 CK57 CK58 CK60 CK67 CK69 J8 J10 J12 J14 J15 J16 R4 R7 R13 R15 R32 R34 R37 R41 R52 R53 R54 R55 R56 R58 R59 R60 R62 R64 R69 R70 R73 R74 R75 R77 R78 R79 R80 R82 R85 R87 R89 R91 R92 R93 R94 U3; alternate parts L8 -> MMZ2012Y152B